# EAGLE design modul (EAGLE 7.2.0)
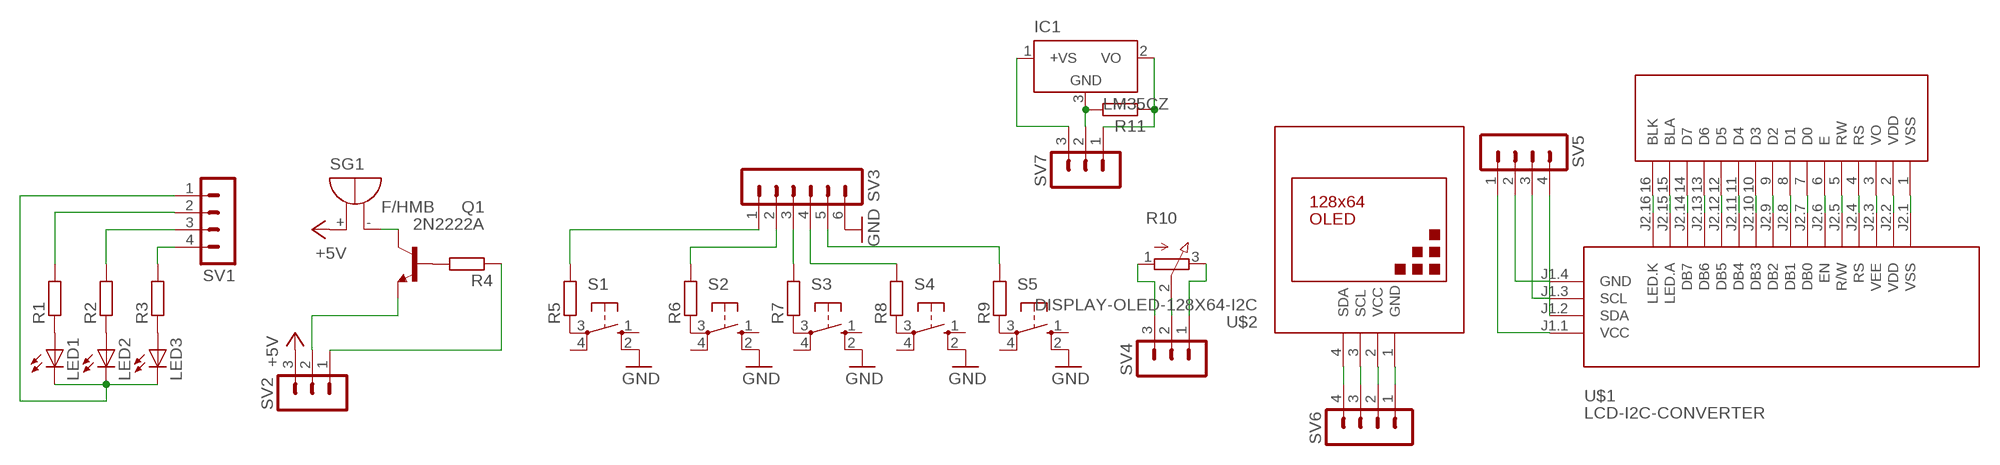
[diagram p0: schematic, sheet 1]

## Parts
IC1  LM35CZ  [TO92]
LED1  LED10MM  [LED10MM]
LED2  LED10MM  [LED10MM]
LED3  LED10MM  [LED10MM]
Q1  2N2222A  [TO18]
R1  R-EU_0204/5  [0204/5]
R2  R-EU_0204/5  [0204/5]
R3  R-EU_0204/5  [0204/5]
R4  R-EU_0204/5  [0204/5]
R5  R-EU_0204/5  [0204/5]
R6  R-EU_0204/5  [0204/5]
R7  R-EU_0204/5  [0204/5]
R8  R-EU_0204/5  [0204/5]
R9  R-EU_0204/5  [0204/5]
R10  3RP/1610N  [3RP/1610N]
R11  R-EU_0204/5  [0204/5]
S1  10-XX  [B3F-10XX]
S2  10-XX  [B3F-10XX]
S3  10-XX  [B3F-10XX]
S4  10-XX  [B3F-10XX]
S5  10-XX  [B3F-10XX]
SG1  F/HMB  [F/HMB]
SV1  MA04-1  [MA04-1]
SV2  MA03-1  [MA03-1]
SV3  MA06-1  [MA06-1]
SV4  MA03-1  [MA03-1]
SV5  MA04-1  [MA04-1]
SV6  MA04-1  [MA04-1]
SV7  MA03-1  [MA03-1]
U$1  LCD-I2C-CONVERTER  [LCD-I2C-CONVERTER]
U$2  DISPLAY-OLED-128X64-I2C  [DISPLAY-OLED-128X64-I2C]
U$3  2X16LCDTOP  [2X16LCDTOP]

## Nets
+5V: SG1.+ SV2.3
GND: S1.2(S1) S2.2(S1) S3.2(S1) S4.2(S1) S5.2(S1) SV3.6
N$1: LED1.A R1.1
N$2: LED2.A R2.1
N$3: LED3.A R3.1
N$4: R3.2 SV1.4
N$6: R2.2 SV1.3
N$7: R1.2 SV1.2
N$9: Q1.3(C) SG1.-
N$10: Q1.2(B) R4.2
N$11: R4.1 SV2.1
N$12: Q1.1(E) SV2.2
N$15: LED1.K(C) LED2.K(C) LED3.K(C) SV1.1
N$16: R5.1 S1.3(P)
N$17: R6.1 S2.3(P)
N$18: R7.1 S3.3(P)
N$19: R8.1 S4.3(P)
N$20: R9.1 S5.3(P)
N$21: R5.2 SV3.1
N$22: R6.2 SV3.2
N$23: R7.2 SV3.3
N$24: R8.2 SV3.4
N$25: R9.2 SV3.5
N$28: R10.2(S) SV4.2
N$29: R10.3(E) SV4.1
N$30: R10.1(A) SV4.3
N$33: U$1.J2.1(VSS) U$3.1(VSS)
N$34: U$1.J2.2(VDD) U$3.2(VDD)
N$35: U$1.J2.3(VEE) U$3.3(VO)
N$36: U$1.J2.4(RS) U$3.4(RS)
N$37: U$1.J2.5(R/W) U$3.5(RW)
N$38: U$1.J2.6(EN) U$3.6(E)
N$39: U$1.J2.7(DB0) U$3.7(D0)
N$40: U$1.J2.8(DB1) U$3.8(D1)
N$41: U$1.J2.9(DB2) U$3.9(D2)
N$42: U$1.J2.10(DB3) U$3.10(D3)
N$43: U$1.J2.11(DB4) U$3.11(D4)
N$44: U$1.J2.12(DB5) U$3.12(D5)
N$45: U$1.J2.13(DB6) U$3.13(D6)
N$46: U$1.J2.14(DB7) U$3.14(D7)
N$47: U$1.J2.15(LED.A) U$3.15(BLA)
N$48: U$1.J2.16(LED.K) U$3.16(BLK)
N$49: SV5.1 U$1.J1.1(VCC)
N$50: SV5.2 U$1.J1.4(GND)
N$51: SV5.3 U$1.J1.3(SCL)
N$52: SV5.4 U$1.J1.2(SDA)
N$53: SV6.1 U$2.1(GND)
N$54: SV6.2 U$2.2(VCC)
N$55: SV6.3 U$2.3(SCL)
N$56: SV6.4 U$2.4(SDA)
N$61: IC1.3(GND) R11.2 SV7.2
N$62: IC1.1(+VS) SV7.3
N$63: IC1.2(VO) R11.1 SV7.1
Unconnected: S1.1(S) S1.4(P1) S2.1(S) S2.4(P1) S3.1(S) S3.4(P1) S4.1(S) S4.4(P1) S5.1(S) S5.4(P1)

## Library data of the parts
IC1 = lm35:LM35: Single-Supply Centigrade Temperature Sensor Vout = (10mV/°C x Temp °C) +5mmmV Source: http://www.national.com/ds/LM/LM35.pdf
LED1-LED3 = led:LED: LED OSRAM: - CHIPLED LG R971, LG N971, LY N971, LG Q971, LY Q971, LO R971, LY R971 LH N974, LH R974 LS Q976, LO Q976, LY Q976 LO Q996 - Hyper CHIPLED LW Q18S LB Q993, LB Q99A, LB R99A - SideLED LS A670, LO A670, LY A670, LG A670, LP A670 LB A673, LV A673, LT A673, LW A673 LH A674 LY A675 LS A676, LA A676, LO A676, LY A676, LW A676 LS A679, LY A679, LG A679 - Hyper Micro SIDELED® LS Y876, LA Y876, LO Y876, LY Y876 LT Y87S - SmartLED LW L88C, LW L88S LB L89C, LB L89S, LG L890 LS L89K, LO L89K, LY L89K LS L896, LA L896, LO L896, LY L896 - TOPLED LS T670, LO T670, LY T670, LG T670, LP T670 LSG T670, LSP T670, LSY T670, LOP T670, LYG T670 LG T671, LOG T671, LSG T671 LB T673, LV T673, LT T673, LW T673 LH T674 LS T676, LA T676, LO T676, LY T676, LB T676, LH T676, LSB T676, LW T676 LB T67C, LV T67C, LT T67C, LS T67K, LO T67K, LY T67K, LW E67C LS E67B, LA E67B, LO E67B, LY E67B, LB E67C, LV E67C, LT E67C LW T67C LS T679, LY T679, LG T679 LS T770, LO T770, LY T770, LG T770, LP T770 LB T773, LV T773, LT T773, LW T773 LH T774 LS E675, LA E675, LY E675, LS T675 LS T776, LA T776, LO T776, LY T776, LB T776 LHGB T686 LT T68C, LB T68C - Hyper Mini TOPLED® LB M676 - Mini TOPLED Santana® LG M470 LS M47K, LO M47K, LY M47K Source: http://www.osram.convergy.de LUXEON: - LUMILED® LXK2-PW12-R00, LXK2-PW12-S00, LXK2-PW14-U00, LXK2-PW14-V00 LXK2-PM12-R00, LXK2-PM12-S00, LXK2-PM14-U00 LXK2-PE12-Q00, LXK2-PE12-R00, LXK2-PE12-S00, LXK2-PE14-T00, LXK2-PE14-U00 LXK2-PB12-K00, LXK2-PB12-L00, LXK2-PB12-M00, LXK2-PB14-N00, LXK2-PB14-P00, LXK2-PB14-Q00 LXK2-PR12-L00, LXK2-PR12-M00, LXK2-PR14-Q00, LXK2-PR14-R00 LXK2-PD12-Q00, LXK2-PD12-R00, LXK2-PD12-S00 LXK2-PH12-R00, LXK2-PH12-S00 LXK2-PL12-P00, LXK2-PL12-Q00, LXK2-PL12-R00 Source: www.luxeon.com KINGBRIGHT: KA-3528ASYC Source: www.kingbright.com
Q1 = transistor-npn:2N2222*: NPN Transistor
R1-R9 R11 = resistor:R-EU_: RESISTOR, European symbol
R10 = pot:3RP/1610N: 16mm Potentiometer one level Source: http://www.alphapotentiometers.net/html/16mm_pot_2.html
S1-S5 = switch-omron:10-XX: OMRON SWITCH; MPN: B3F-1000; OC_FARNELL: 176432; OC_NEWARK: 36M3542
SG1 = buzzer:F/HMB: BUZZER Source: Buerklin; OC_FARNELL: unknown; OC_NEWARK: unknown
SV1 SV5 SV6 = con-lstb:MA04-1: PIN HEADER; OC_FARNELL: unknown; OC_NEWARK: unknown
SV2 SV4 SV7 = con-lstb:MA03-1: PIN HEADER; OC_FARNELL: unknown; OC_NEWARK: unknown
SV3 = con-lstb:MA06-1: PIN HEADER; OC_FARNELL: unknown; OC_NEWARK: unknown
U$1 = diy-modules:LCD-I2C-CONVERTER: I2C Bus to 4-Bit Parallel LCD Interface with LED backlight driver
U$2 = diy-modules:DISPLAY-OLED-128X64-I2C: 128x64 Dot Matrix OLED Module based on SSD1306 chip Variant with I2C interface More details available here: http://www.instructables.com/id/Monochrome-096-i2c-OLED-display-with-arduino-SSD13/ SSD1306 datasheet: https://cdn-shop.adafruit.com/datasheets/SSD1306.pdf Click here to find device on ebay.com <http://www.ebay.com/sch/oled+display+128x64+iic> Note: There are two variants: I2C and SPI. Search for the proper version.
U$3 = lcd_modules_ece:2X16LCDTOP

## Board
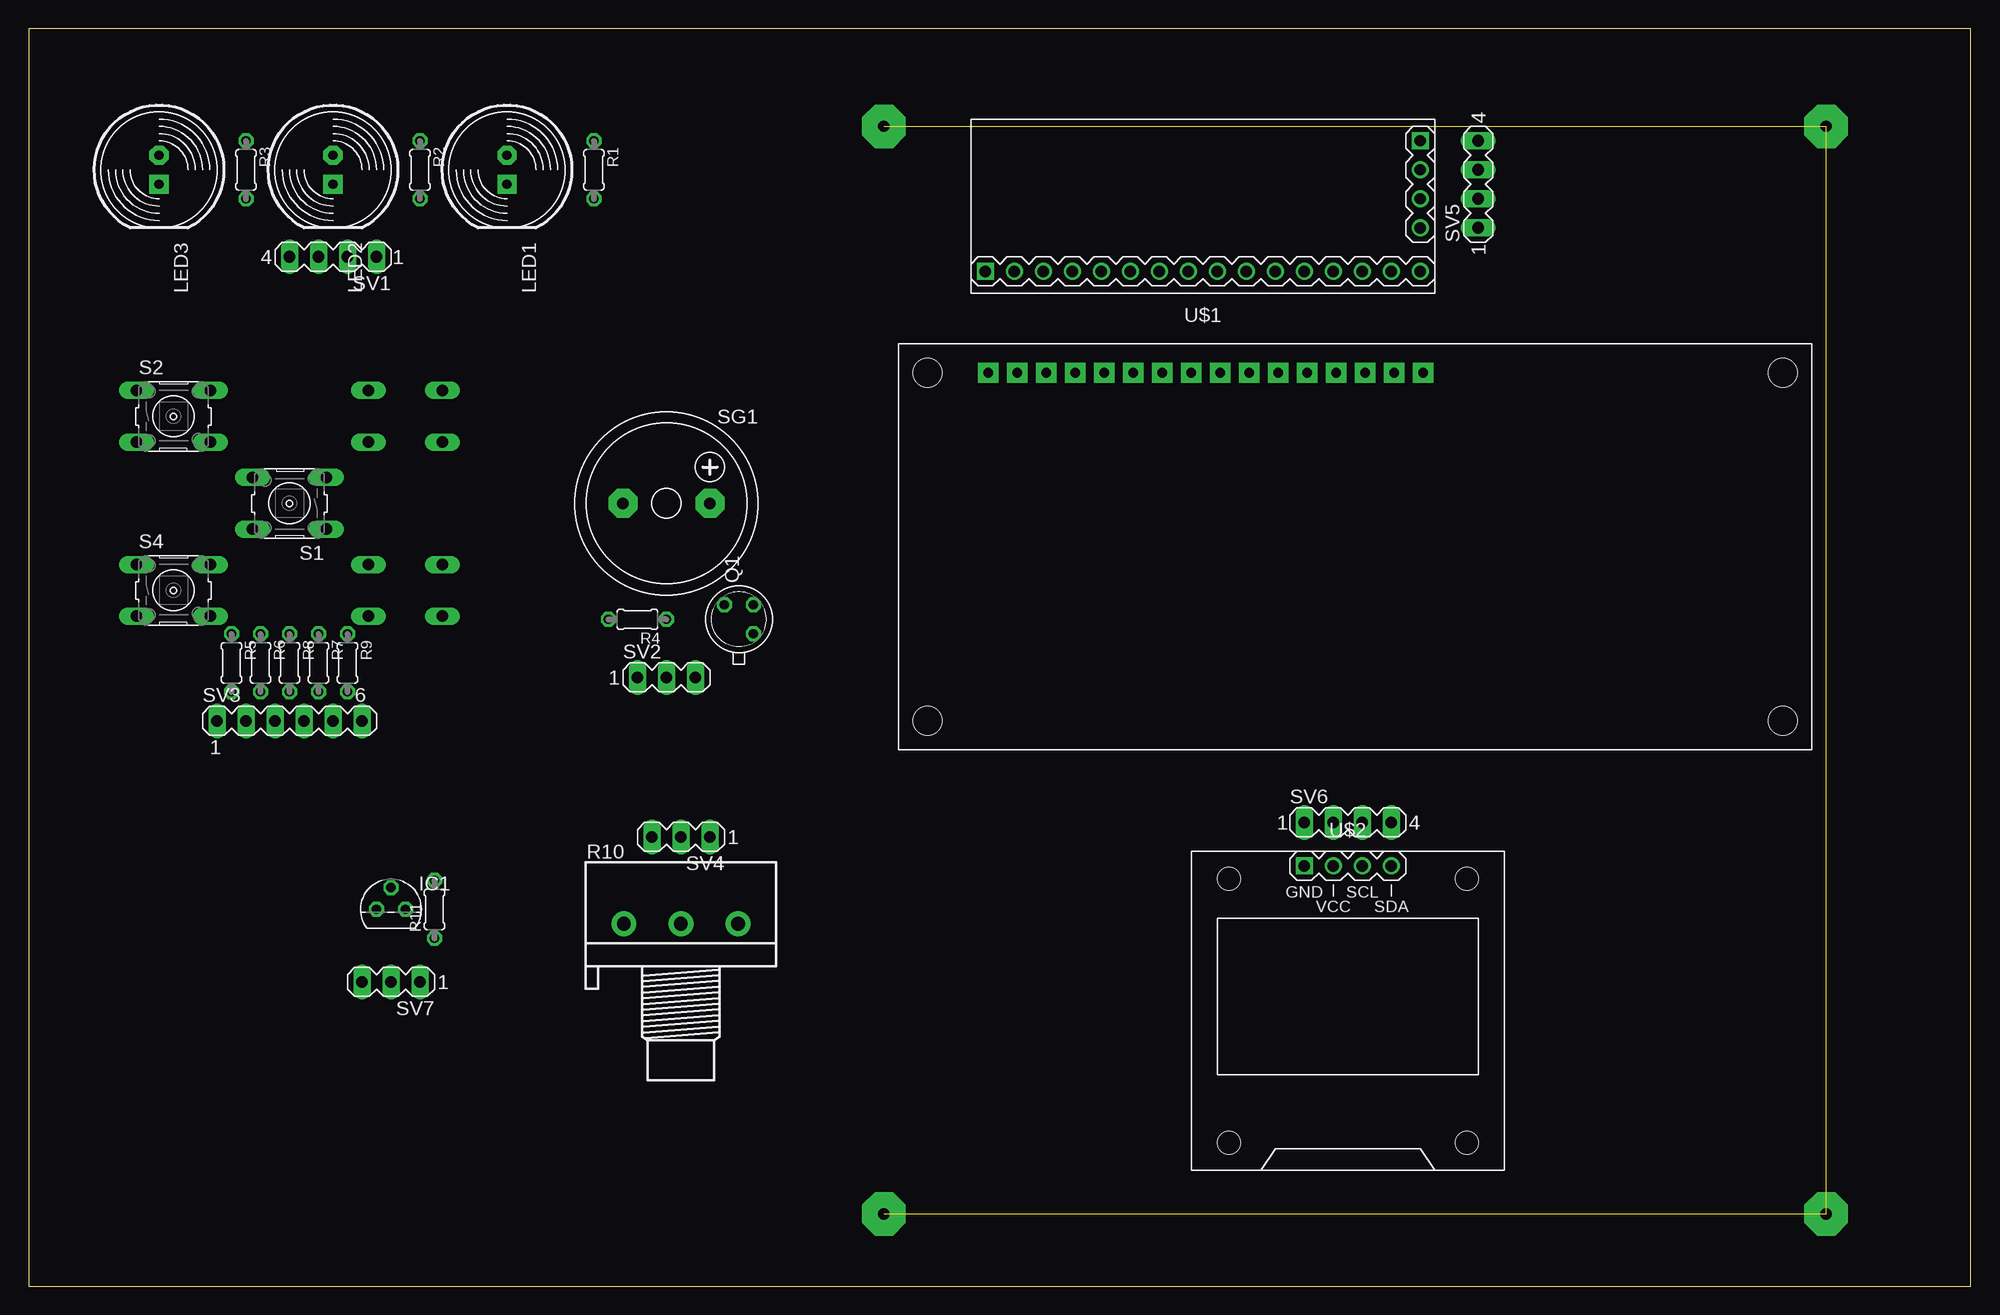
[diagram p1: board, top side]
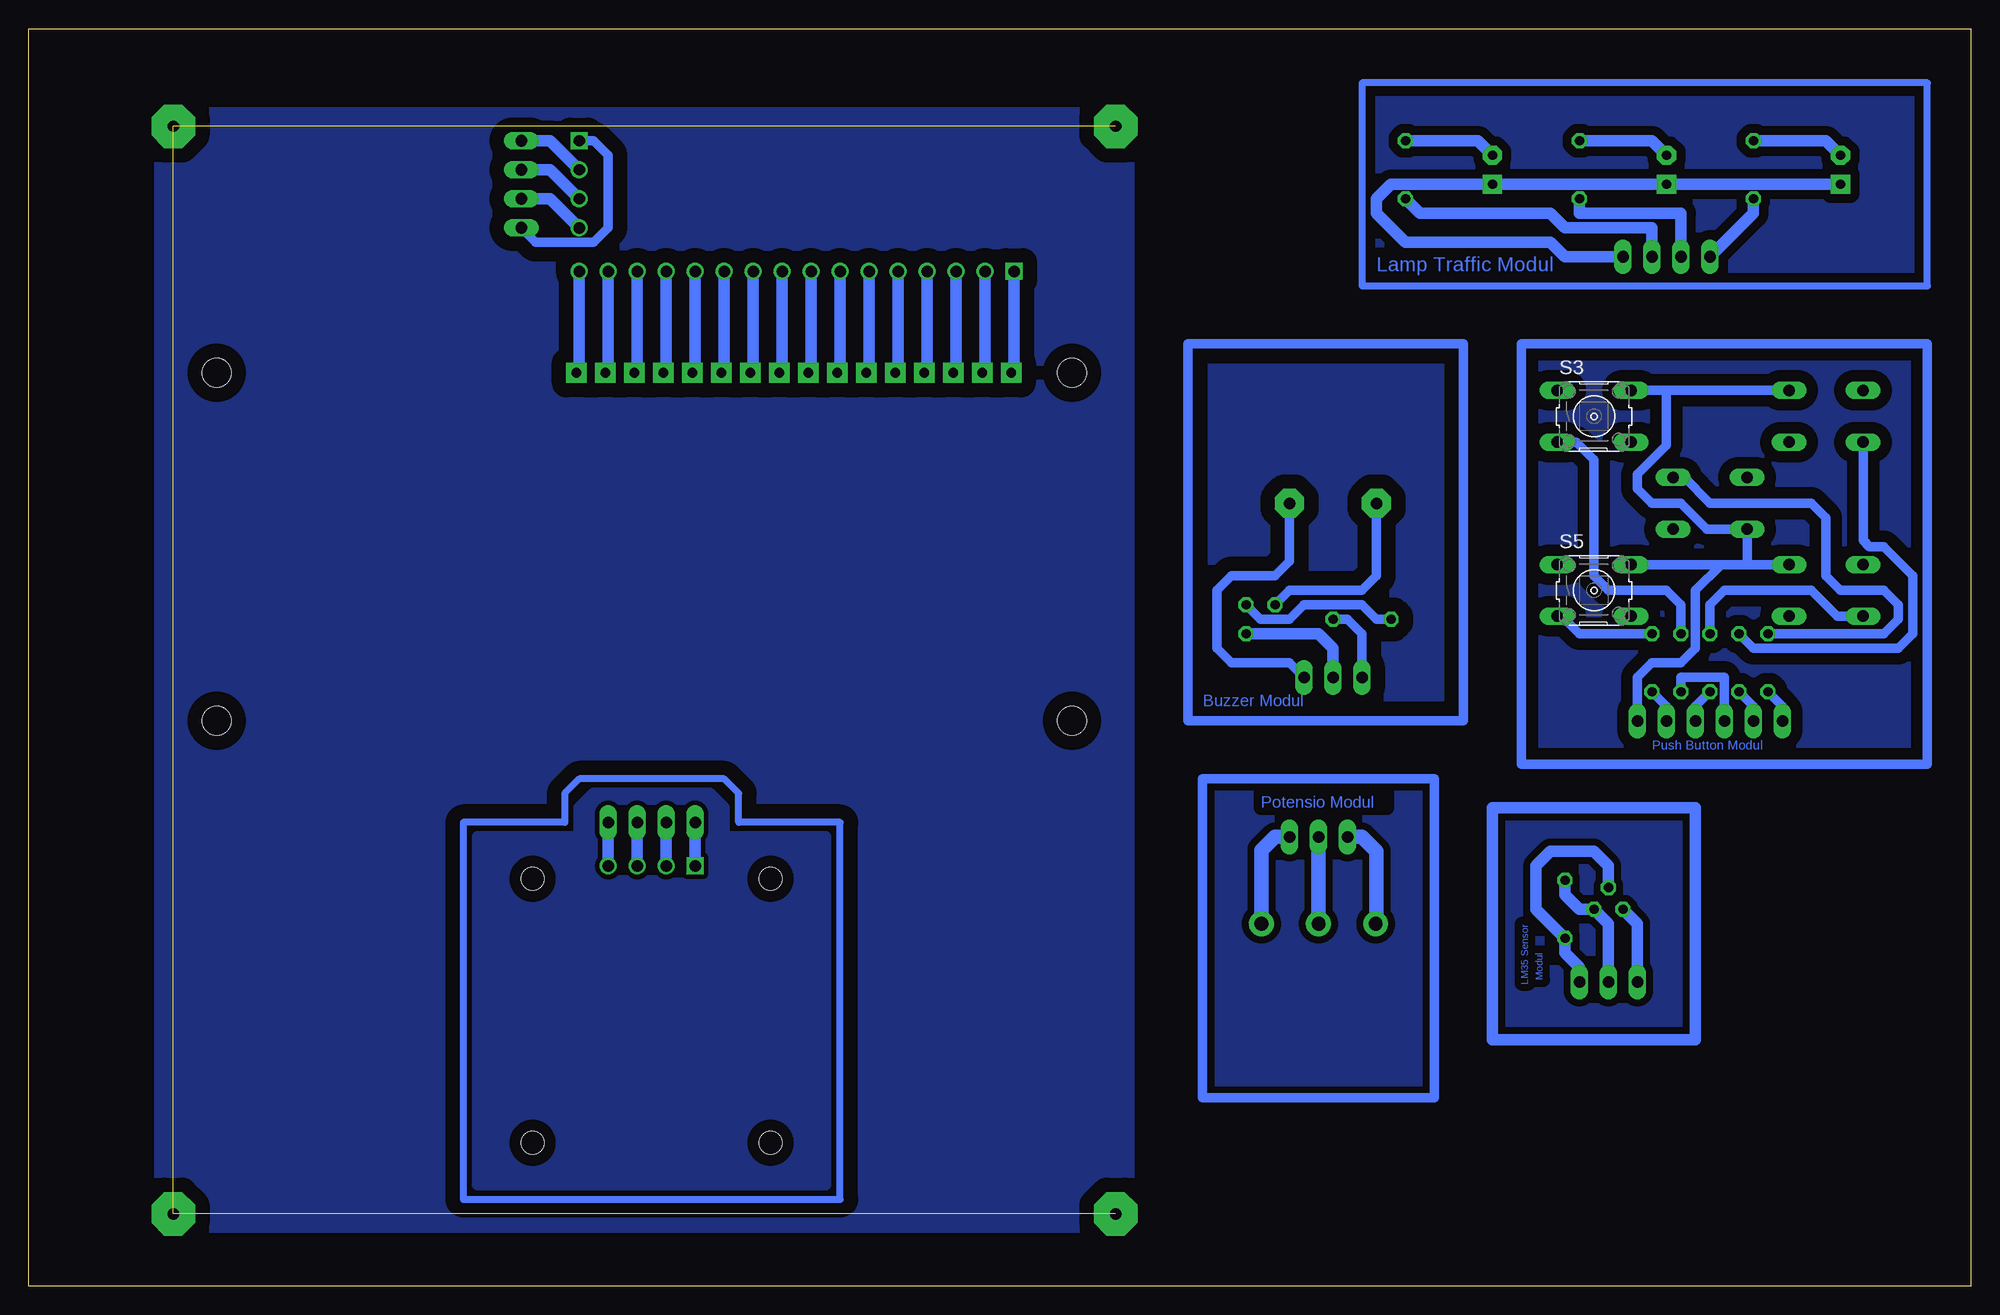
[diagram p2: board, bottom side, seen from below]

Size 170.16 x 110.16 mm. Coordinates in mm from the lower left corner, seen from the top.
Outline: 0,0 170.16,0 170.16,110.16 0,110.16 0,0
Copper layers (1*16): Top 0.035mm / dielectric 1.5mm / Bottom 0.035mm
Design rules "default": minimum track width 10mil, minimum drill 24mil, track to track 8mil, track to pad 8mil, pad to pad 8mil, via to via 8mil, smd to smd 8mil, copper to edge 40mil, drill to drill 8mil, minimum pad ring 10mil, minimum via ring 8mil, stop-mask expansion 4mil, vias tented up to drill 0mil, thermal gap 10mil

### Footprints (pad centres in the part's own frame; a part is rotated, then mirrored left to right if it is on the bottom)
TO92 = drill 0.813 octagon: 1 -1.27,0; 2 0,1.905; 3 1.27,0
LED10MM = drill 0.813 pad 1.676 octagon: A -1.27,0 | drill 0.813 pad 1.676 square: K 1.27,0
TO18 = drill 0.813 octagon: 1 -1.27,-1.27; 2 1.27,-1.27; 3 1.27,1.27
0204/5 = drill 0.813 octagon: 1 -2.54,0; 2 2.54,0
3RP/1610N = drill 1.2 pad 2.184: 1 -5,0; 2 0,0; 3 5,0
B3F-10XX = drill 1.016 long: 1 -3.251,2.261; 2 3.251,2.261; 3 -3.251,-2.261; 4 3.251,-2.261
F/HMB = drill 1.016 pad 2.54 octagon: + 3.81,0; - -3.81,0
MA04-1 = drill 1.016 long: 1 -3.81,0; 2 -1.27,0; 3 1.27,0; 4 3.81,0
MA03-1 = drill 1.016 long: 1 -2.54,0; 2 0,0; 3 2.54,0
MA06-1 = drill 1.016 long: 1 -6.35,0; 2 -3.81,0; 3 -1.27,0; 4 1.27,0; 5 3.81,0; 6 6.35,0
LCD-I2C-CONVERTER = drill 1 square: J1.1 -19.05,-5.08; J2.1 19.05,6.35 | drill 1: J1.2 -19.05,-2.54; J1.3 -19.05,0; J1.4 -19.05,2.54; J2.2 16.51,6.35; J2.3 13.97,6.35; J2.4 11.43,6.35; J2.5 8.89,6.35; J2.6 6.35,6.35; J2.7 3.81,6.35; J2.8 1.27,6.35; J2.9 -1.27,6.35; J2.10 -3.81,6.35; J2.11 -6.35,6.35; J2.12 -8.89,6.35; J2.13 -11.43,6.35; J2.14 -13.97,6.35; J2.15 -16.51,6.35; J2.16 -19.05,6.35
DISPLAY-OLED-128X64-I2C = drill 1 square: 1 -3.81,12.7 | drill 1: 2 -1.27,12.7; 3 1.27,12.7; 4 3.81,12.7 | hole 2: -10.414,11.557; 10.414,11.557; 10.414,-11.557; -10.414,-11.557
2X16LCDTOP = drill 0.85 pad 1.778 square: 1 7.87,33.02; 2 10.41,33.02; 3 12.95,33.02; 4 15.49,33.02; 5 18.03,33.02; 6 20.57,33.02; 7 23.11,33.02; 8 25.65,33.02; 9 28.19,33.02; 10 30.73,33.02; 11 33.27,33.02; 12 35.81,33.02; 13 38.35,33.02; 14 40.89,33.02; 15 43.43,33.02; 16 45.97,33.02 | hole 2.54: 2.54,33.02; 77.47,33.02; 77.47,2.54; 2.54,2.54

### Placement (x,y rotation side)
IC1  31.75,33.02 0 top
LED1  41.91,97.79 270 top
LED2  26.67,97.79 270 top
LED3  11.43,97.79 270 top
Q1  62.23,58.42 90 top
R1  49.53,97.79 270 top
R2  34.29,97.79 270 top
R3  19.05,97.79 270 top
R4  53.34,58.42 180 top
R5  17.78,54.61 270 top
R6  20.32,54.61 270 top
R7  25.4,54.61 270 top
R8  22.86,54.61 270 top
R9  27.94,54.61 270 top
R10  57.15,31.75 0 top
R11  35.56,33.02 90 top
S1  22.86,68.58 180 top
S2  12.7,76.2 0 top
S3  33.02,76.2 0 bottom
S4  12.7,60.96 0 top
S5  33.02,60.96 0 bottom
SG1  55.88,68.58 0 top
SV1  26.67,90.17 180 top
SV2  55.88,53.34 0 top
SV3  22.86,49.53 0 top
SV4  57.15,39.37 180 top
SV5  127,96.52 90 top
SV6  115.57,40.64 0 top
SV7  31.75,26.67 180 top
U$1  102.87,95.25 180 top
U$2  115.57,24.13 0 top
U$3  76.2,46.99 0 top

### Tracks (layer width: path | path; a pad name or v marks a point on that pad's centre or on a via)
+5V
  Bottom 0.813: SV2.3 59.69,54.61 64.77,54.61 66.04,55.88 66.04,60.96 64.77,62.23 60.96,62.23 59.69,63.5 SG1.+
GND
  Bottom 0.813: S2.2 26.67,78.46 | 26.67,78.46 S3.2 | S4.2 19.61,63.22 | 21.87,63.22 S5.2 | 19.61,63.22 S1.2 23.14,66.32 25.4,68.58 27.94,68.58 29.21,69.85 29.21,71.12 26.67,73.66 26.67,78.46 | 19.61,63.22 21.87,63.22 | 21.87,63.22 24.13,60.96 24.13,55.88 25.4,54.61 27.94,54.61 29.21,53.34 SV3.6
N$1
  Bottom 1.016: R1.1 43.18,100.33 LED1.A
N$2
  Bottom 1.016: R2.1 27.94,100.33 LED2.A
N$3
  Bottom 1.016: R3.1 12.7,100.33 LED3.A
N$4
  Bottom 1.016: SV1.4 19.05,93.98 R3.2
N$5
  Bottom 0.61: 53.34,105.41 53.34,87.63 3.81,87.63 3.81,105.41 53.34,105.41
N$6
  Bottom 1.016: SV1.3 25.4,93.98 34.29,93.98 R2.2
N$7
  Bottom 1.016: SV1.2 27.94,92.71 35.56,92.71 36.83,93.98 48.26,93.98 R1.2
N$8
  pour Bottom (isolate 0.813): 52.07,104.14 52.07,88.9 5.08,88.9 5.08,104.14
N$9
  Bottom 0.813: SG1.- 52.07,62.23 53.34,60.96 59.69,60.96 Q1.3
N$10
  Bottom 0.813: Q1.2 62.23,58.42 59.69,58.42 58.42,59.69 53.34,59.69 52.07,58.42 R4.2
N$11
  Bottom 0.813: SV2.1 53.34,57.15 54.61,58.42 R4.1
N$12
  Bottom 1.016: SV2.2 55.88,55.88 57.15,57.15 Q1.1
N$13
  Bottom 0.813: 44.45,82.55 68.58,82.55 68.58,49.53 44.45,49.53 44.45,82.55
N$14
  pour Bottom (isolate 1.27): 45.72,81.28 67.31,81.28 67.31,50.8 45.72,50.8
N$15
  Bottom 1.016: LED3.K LED2.K LED1.K 50.8,96.52 52.07,95.25 52.07,93.98 49.53,91.44 36.83,91.44 35.56,90.17 SV1.1
N$16
  Bottom 0.813: R5.1 7.62,57.15 6.35,58.42 6.35,59.69 7.62,60.96 11.43,60.96 12.7,62.23 12.7,67.31 13.97,68.58 22.86,68.58 25.12,70.84 S1.3
N$17
  Bottom 0.813: R6.1 19.05,55.88 6.35,55.88 5.08,57.15 5.08,62.23 7.62,64.77 8.89,64.77 9.45,65.33 S2.3
N$18
  Bottom 0.813: R7.1 25.4,59.69 26.67,60.96 31.75,60.96 33.02,62.23 33.02,72.39 34.57,73.94 S3.3
N$19
  Bottom 0.813: R8.1 22.86,59.69 21.59,60.96 13.97,60.96 11.71,58.7 S4.3
N$20
  Bottom 0.813: S5.3 35.84,58.7 34.29,57.15 R9.1
N$21
  Bottom 0.813: R5.2 16.51,50.8 SV3.1
N$22
  Bottom 0.813: R6.2 19.05,50.8 SV3.2
N$23
  Bottom 0.813: R7.2 25.4,53.34 21.59,53.34 SV3.3
N$24
  Bottom 0.813: R8.2 24.13,50.8 SV3.4
N$25
  Bottom 0.813: SV3.5 26.67,50.8 R9.2
N$26
  Bottom 0.813: 3.81,82.55 39.37,82.55 39.37,45.72 3.81,45.72 3.81,82.55
N$27
  pour Bottom (isolate 1.016): 5.08,81.28 38.1,81.28 38.1,46.99 5.08,46.99
N$28
  Bottom 1.27: SV4.2 R10.2
N$29
  Bottom 1.27: R10.3 62.15,38.18 60.96,39.37 SV4.1
N$30
  Bottom 1.27: SV4.3 53.34,39.37 52.07,38.1 52.07,31.83 R10.1
N$31
  pour Bottom (isolate 0.61): 48.26,43.18 66.04,43.18 66.04,17.78 48.26,17.78
N$32
  Bottom 0.813: 46.99,44.45 67.31,44.45 67.31,16.51 46.99,16.51 46.99,44.45
N$33
  Bottom 1.016: U$1.J2.1 83.82,80.26 U$3.1
N$34
  Bottom 1.016: U$1.J2.2 86.36,80.26 U$3.2
N$35
  Bottom 1.016: U$1.J2.3 88.9,80.26 U$3.3
N$36
  Bottom 1.016: U$1.J2.4 91.44,80.26 U$3.4
N$37
  Bottom 1.016: U$1.J2.5 93.98,80.26 U$3.5
N$38
  Bottom 1.016: U$1.J2.6 96.52,80.26 U$3.6
N$39
  Bottom 1.016: U$1.J2.7 99.06,80.26 U$3.7
N$40
  Bottom 1.016: U$1.J2.8 101.6,80.26 U$3.8
N$41
  Bottom 1.016: U$1.J2.9 104.14,80.26 U$3.9
N$42
  Bottom 1.016: U$1.J2.10 106.68,80.26 U$3.10
N$43
  Bottom 1.016: U$1.J2.11 109.22,80.26 U$3.11
N$44
  Bottom 1.016: U$1.J2.12 111.76,80.26 U$3.12
N$45
  Bottom 1.016: U$1.J2.13 114.3,80.26 U$3.13
N$46
  Bottom 1.016: U$1.J2.14 116.84,80.26 U$3.14
N$47
  Bottom 1.016: U$1.J2.15 119.38,80.26 U$3.15
N$48
  Bottom 1.016: U$1.J2.16 121.92,80.26 U$3.16
N$49
  Bottom 0.813: SV5.1 125.73,91.44 120.65,91.44 119.38,92.71 119.38,99.06 120.65,100.33 U$1.J1.1
N$50
  Bottom 1.016: U$1.J1.4 124.46,95.25 SV5.2
N$51
  Bottom 1.016: U$1.J1.3 124.46,97.79 SV5.3
N$52
  Bottom 1.016: U$1.J1.2 124.46,100.33 SV5.4
N$53
  Bottom 1.016: U$2.1 SV6.1
N$54
  Bottom 1.016: SV6.2 U$2.2
N$55
  Bottom 1.016: SV6.3 U$2.3
N$56
  Bottom 1.016: SV6.4 U$2.4
N$57
  pour Bottom (isolate 0.406): 110.49,43.18 120.65,43.18 121.92,41.91 121.92,39.37 130.81,39.37 130.81,8.89 100.33,8.89 100.33,39.37 109.22,39.37 109.22,41.91
N$58
  Bottom 0.61: 109.22,44.45 121.92,44.45 123.19,43.18 123.19,40.64 132.08,40.64 132.08,7.62 99.06,7.62 99.06,40.64 107.95,40.64 107.95,43.18 109.22,44.45
N$59
  pour Bottom (isolate 1.27): 73.66,5.08 73.66,102.87 158.75,102.87 158.75,5.08
N$60  (via drill 1 pad 3.81)  (3 unrouted)
  other vias: 74.93,101.6 157.48,101.6 157.48,6.35 74.93,6.35
N$61
  Bottom 1.016: R11.2 35.56,34.29 34.29,33.02 IC1.3 31.75,31.75 SV7.2
N$62
  Bottom 1.016: SV7.3 29.21,31.75 IC1.1
N$63
  Bottom 1.016: SV7.1 34.29,27.94 35.56,29.21 R11.1 38.1,33.02 38.1,36.83 36.83,38.1 33.02,38.1 31.75,36.83 IC1.2
N$64
  pour Bottom (isolate 0.61): 25.4,40.64 40.64,40.64 40.64,22.86 25.4,22.86
N$65
  Bottom 1.016: 24.13,41.91 41.91,41.91 41.91,21.59 24.13,21.59 24.13,41.91

### Text on the board
Bottom: Lamp Traffic Modul | Buzzer Modul | Push Button Modul | Potensio Modul | LM35 Sensor | Modul